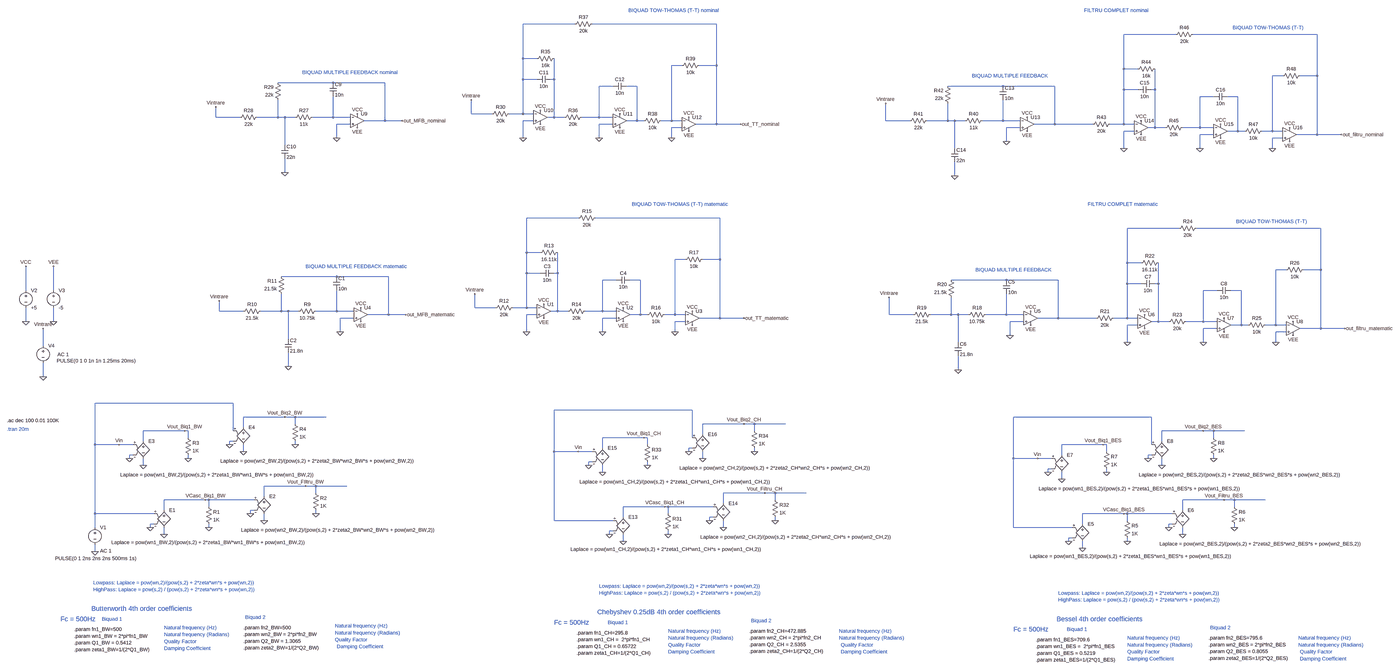
[diagram p0: schematic TJ_ARY_NOMINAL_E24.asc, whole sheet]
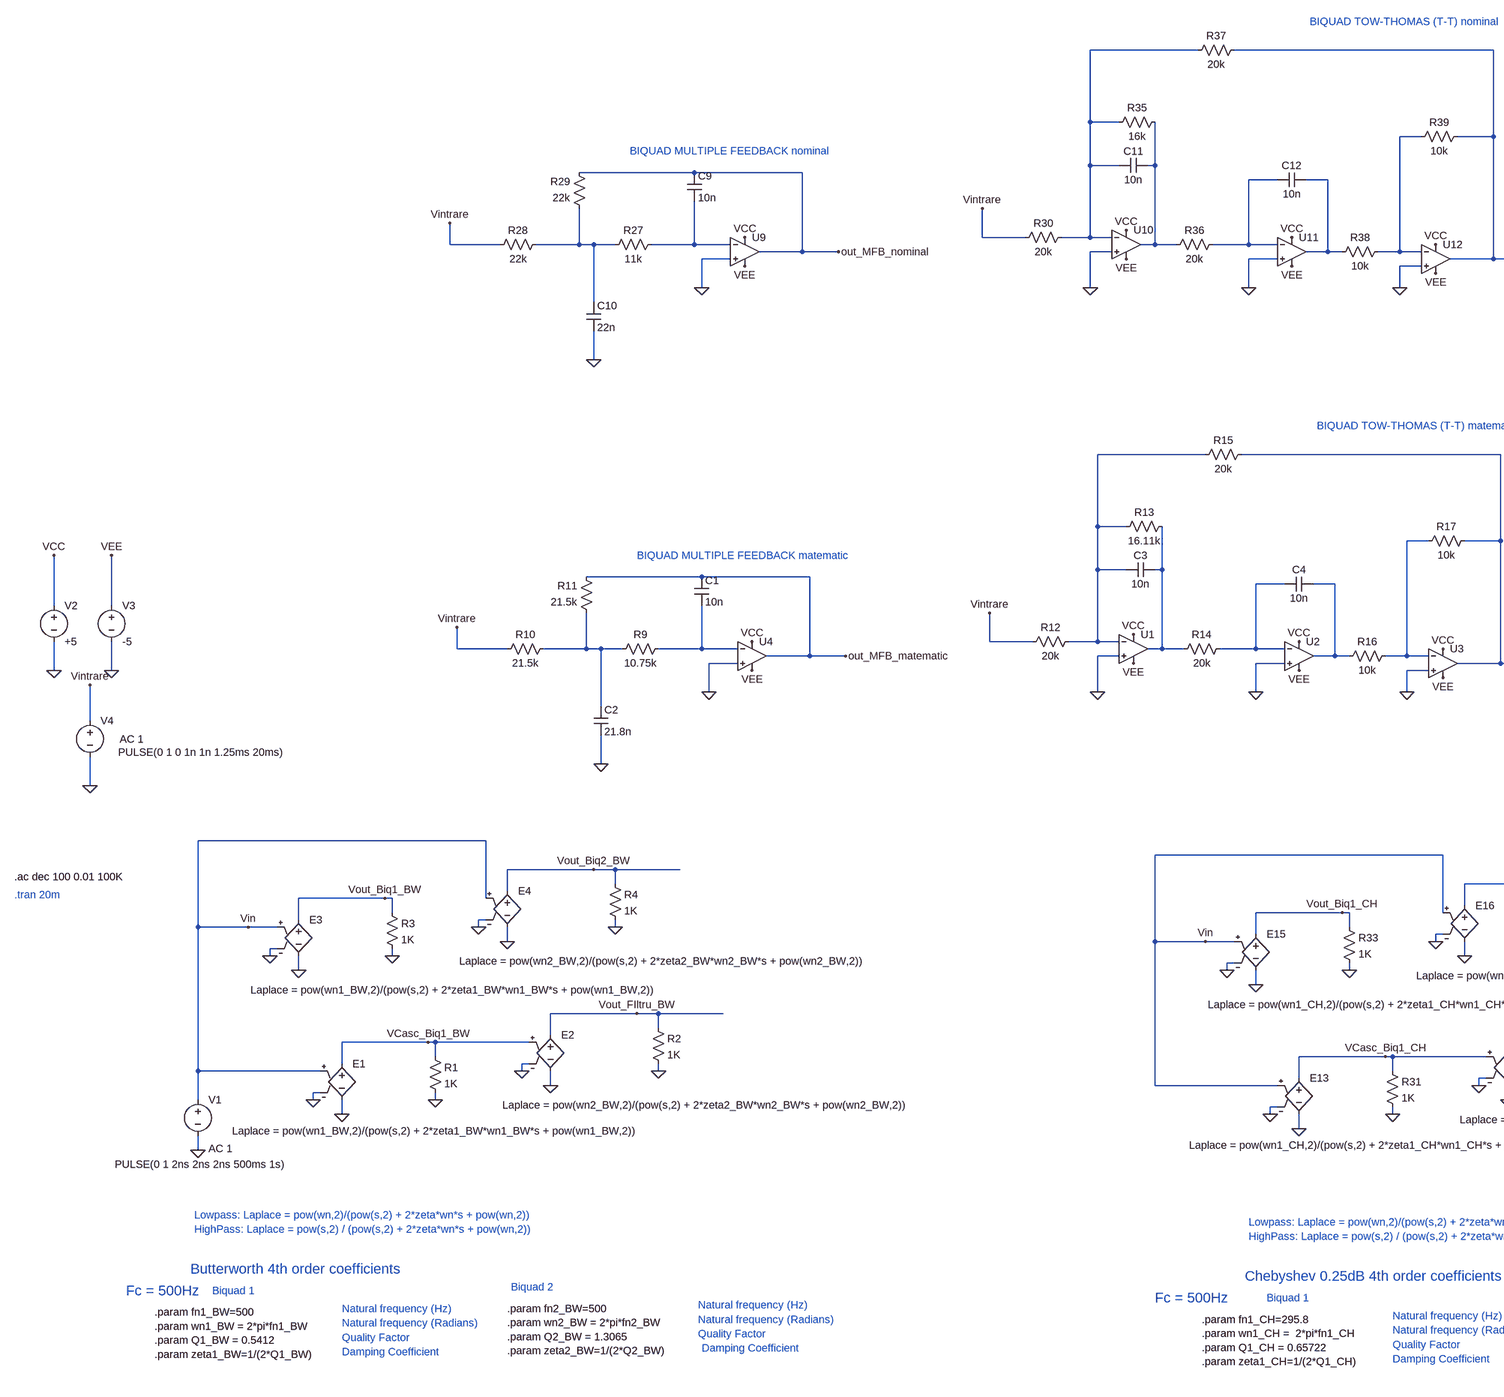
[diagram p1: schematic TJ_ARY_NOMINAL_E24.asc, part, row 1 of 1, column 1 of 2]
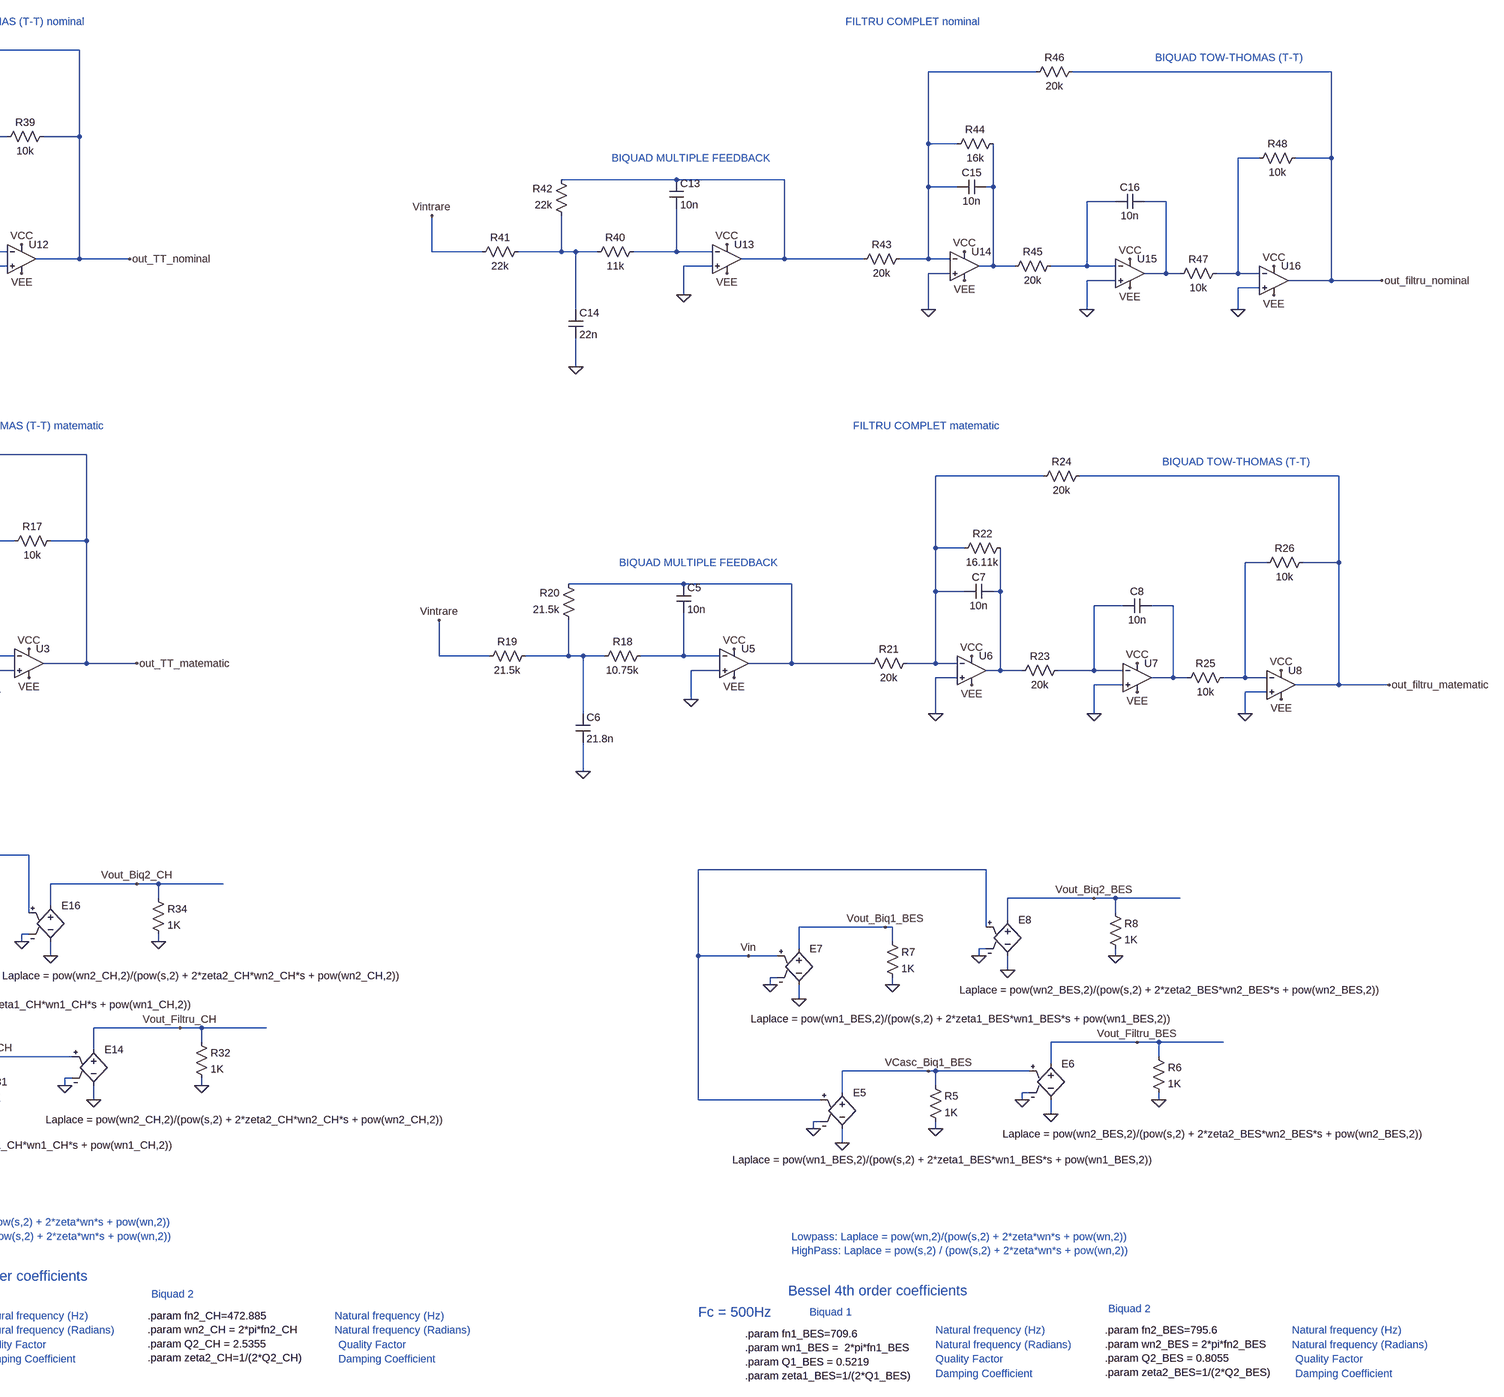
[diagram p2: schematic TJ_ARY_NOMINAL_E24.asc, part, row 1 of 1, column 2 of 2]
TJ_ARY_NOMINAL_E24.asc, the LTspice schematic file:
Version 4.1
SHEET 1 6776 2576
WIRE 2480 -1856 2240 -1856
WIRE 3136 -1856 2560 -1856
WIRE 5264 -1808 5024 -1808
WIRE 5920 -1808 5344 -1808
WIRE 2240 -1696 2240 -1856
WIRE 2304 -1696 2240 -1696
WIRE 2976 -1664 2928 -1664
WIRE 3136 -1664 3136 -1856
WIRE 3136 -1664 3056 -1664
WIRE 5024 -1648 5024 -1808
WIRE 5088 -1648 5024 -1648
WIRE 5760 -1616 5712 -1616
WIRE 5920 -1616 5920 -1808
WIRE 5920 -1616 5840 -1616
WIRE 2240 -1600 2240 -1696
WIRE 2304 -1600 2240 -1600
WIRE 2384 -1600 2384 -1696
WIRE 2384 -1600 2368 -1600
WIRE 1360 -1584 1104 -1584
WIRE 1600 -1584 1360 -1584
WIRE 2656 -1568 2592 -1568
WIRE 2768 -1568 2720 -1568
WIRE 4464 -1568 4208 -1568
WIRE 4704 -1568 4464 -1568
WIRE 5024 -1552 5024 -1648
WIRE 5088 -1552 5024 -1552
WIRE 5168 -1552 5168 -1648
WIRE 5168 -1552 5152 -1552
WIRE 5440 -1520 5376 -1520
WIRE 5552 -1520 5504 -1520
WIRE 2000 -1440 2000 -1504
WIRE 2096 -1440 2000 -1440
WIRE 2240 -1440 2240 -1600
WIRE 2240 -1440 2176 -1440
WIRE 2288 -1440 2240 -1440
WIRE 816 -1424 816 -1472
WIRE 928 -1424 816 -1424
WIRE 1104 -1424 1104 -1504
WIRE 1104 -1424 1008 -1424
WIRE 1136 -1424 1104 -1424
WIRE 1184 -1424 1136 -1424
WIRE 1360 -1424 1360 -1520
WIRE 1360 -1424 1264 -1424
WIRE 1440 -1424 1360 -1424
WIRE 2384 -1424 2384 -1600
WIRE 2384 -1424 2352 -1424
WIRE 2432 -1424 2384 -1424
WIRE 2592 -1424 2592 -1568
WIRE 2592 -1424 2512 -1424
WIRE 2656 -1424 2592 -1424
WIRE 1600 -1408 1600 -1584
WIRE 1600 -1408 1504 -1408
WIRE 1680 -1408 1600 -1408
WIRE 2288 -1408 2240 -1408
WIRE 2768 -1408 2768 -1568
WIRE 2768 -1408 2720 -1408
WIRE 2800 -1408 2768 -1408
WIRE 2928 -1408 2928 -1664
WIRE 2928 -1408 2880 -1408
WIRE 2976 -1408 2928 -1408
WIRE 3920 -1408 3920 -1488
WIRE 4032 -1408 3920 -1408
WIRE 4208 -1408 4208 -1488
WIRE 4208 -1408 4112 -1408
WIRE 4240 -1408 4208 -1408
WIRE 4288 -1408 4240 -1408
WIRE 4464 -1408 4464 -1504
WIRE 4464 -1408 4368 -1408
WIRE 4544 -1408 4464 -1408
WIRE 1440 -1392 1376 -1392
WIRE 2656 -1392 2592 -1392
WIRE 3136 -1392 3136 -1664
WIRE 3136 -1392 3040 -1392
WIRE 3248 -1392 3136 -1392
WIRE 4704 -1392 4704 -1568
WIRE 4704 -1392 4608 -1392
WIRE 4880 -1392 4704 -1392
WIRE 5024 -1392 5024 -1552
WIRE 5024 -1392 4960 -1392
WIRE 5072 -1392 5024 -1392
WIRE 2976 -1376 2928 -1376
WIRE 4544 -1376 4480 -1376
WIRE 5168 -1376 5168 -1552
WIRE 5168 -1376 5136 -1376
WIRE 5216 -1376 5168 -1376
WIRE 5376 -1376 5376 -1520
WIRE 5376 -1376 5296 -1376
WIRE 5440 -1376 5376 -1376
WIRE 5072 -1360 5024 -1360
WIRE 5552 -1360 5552 -1520
WIRE 5552 -1360 5504 -1360
WIRE 5584 -1360 5552 -1360
WIRE 5712 -1360 5712 -1616
WIRE 5712 -1360 5664 -1360
WIRE 5760 -1360 5712 -1360
WIRE 5440 -1344 5376 -1344
WIRE 5920 -1344 5920 -1616
WIRE 5920 -1344 5824 -1344
WIRE 6032 -1344 5920 -1344
WIRE 1376 -1328 1376 -1392
WIRE 2240 -1328 2240 -1408
WIRE 2592 -1328 2592 -1392
WIRE 2928 -1328 2928 -1376
WIRE 5760 -1328 5712 -1328
WIRE 4480 -1312 4480 -1376
WIRE 1136 -1296 1136 -1424
WIRE 4240 -1280 4240 -1408
WIRE 5024 -1280 5024 -1360
WIRE 5376 -1280 5376 -1344
WIRE 5712 -1280 5712 -1328
WIRE 1136 -1168 1136 -1232
WIRE 4240 -1152 4240 -1216
WIRE 2496 -944 2256 -944
WIRE 3152 -944 2576 -944
WIRE 5280 -896 5040 -896
WIRE 5936 -896 5360 -896
WIRE 2256 -784 2256 -944
WIRE 2320 -784 2256 -784
WIRE 2992 -752 2944 -752
WIRE 3152 -752 3152 -944
WIRE 3152 -752 3072 -752
WIRE 5040 -736 5040 -896
WIRE 5104 -736 5040 -736
WIRE 5776 -704 5728 -704
WIRE 5936 -704 5936 -896
WIRE 5936 -704 5856 -704
WIRE 2256 -688 2256 -784
WIRE 2320 -688 2256 -688
WIRE 2400 -688 2400 -784
WIRE 2400 -688 2384 -688
WIRE 1376 -672 1120 -672
WIRE 1616 -672 1376 -672
WIRE 2672 -656 2608 -656
WIRE 2784 -656 2736 -656
WIRE 4480 -656 4224 -656
WIRE 4720 -656 4480 -656
WIRE 5040 -640 5040 -736
WIRE 5104 -640 5040 -640
WIRE 5184 -640 5184 -736
WIRE 5184 -640 5168 -640
WIRE -64 -608 -64 -720
WIRE 64 -608 64 -720
WIRE 5456 -608 5392 -608
WIRE 5568 -608 5520 -608
WIRE 2016 -528 2016 -592
WIRE 2112 -528 2016 -528
WIRE 2256 -528 2256 -688
WIRE 2256 -528 2192 -528
WIRE 2304 -528 2256 -528
WIRE 832 -512 832 -560
WIRE 944 -512 832 -512
WIRE 1120 -512 1120 -592
WIRE 1120 -512 1024 -512
WIRE 1152 -512 1120 -512
WIRE 1200 -512 1152 -512
WIRE 1376 -512 1376 -608
WIRE 1376 -512 1280 -512
WIRE 1456 -512 1376 -512
WIRE 2400 -512 2400 -688
WIRE 2400 -512 2368 -512
WIRE 2448 -512 2400 -512
WIRE 2608 -512 2608 -656
WIRE 2608 -512 2528 -512
WIRE 2672 -512 2608 -512
WIRE 1616 -496 1616 -672
WIRE 1616 -496 1520 -496
WIRE 1696 -496 1616 -496
WIRE 2304 -496 2256 -496
WIRE 2784 -496 2784 -656
WIRE 2784 -496 2736 -496
WIRE 2816 -496 2784 -496
WIRE 2944 -496 2944 -752
WIRE 2944 -496 2896 -496
WIRE 2992 -496 2944 -496
WIRE 3936 -496 3936 -576
WIRE 4048 -496 3936 -496
WIRE 4224 -496 4224 -576
WIRE 4224 -496 4128 -496
WIRE 4256 -496 4224 -496
WIRE 4304 -496 4256 -496
WIRE 4480 -496 4480 -592
WIRE 4480 -496 4384 -496
WIRE 4560 -496 4480 -496
WIRE 1456 -480 1392 -480
WIRE 2672 -480 2608 -480
WIRE 3152 -480 3152 -752
WIRE 3152 -480 3056 -480
WIRE 3264 -480 3152 -480
WIRE 4720 -480 4720 -656
WIRE 4720 -480 4624 -480
WIRE 4896 -480 4720 -480
WIRE 5040 -480 5040 -640
WIRE 5040 -480 4976 -480
WIRE 5088 -480 5040 -480
WIRE -64 -464 -64 -528
WIRE 64 -464 64 -528
WIRE 2992 -464 2944 -464
WIRE 4560 -464 4496 -464
WIRE 5184 -464 5184 -640
WIRE 5184 -464 5152 -464
WIRE 5232 -464 5184 -464
WIRE 5392 -464 5392 -608
WIRE 5392 -464 5312 -464
WIRE 5456 -464 5392 -464
WIRE 5088 -448 5040 -448
WIRE 5568 -448 5568 -608
WIRE 5568 -448 5520 -448
WIRE 5600 -448 5568 -448
WIRE 5728 -448 5728 -704
WIRE 5728 -448 5680 -448
WIRE 5776 -448 5728 -448
WIRE 5456 -432 5392 -432
WIRE 5936 -432 5936 -704
WIRE 5936 -432 5840 -432
WIRE 6048 -432 5936 -432
WIRE 1392 -416 1392 -480
WIRE 2256 -416 2256 -496
WIRE 2608 -416 2608 -480
WIRE 2944 -416 2944 -464
WIRE 5776 -416 5728 -416
WIRE 4496 -400 4496 -464
WIRE 1152 -384 1152 -512
WIRE 4256 -368 4256 -496
WIRE 5040 -368 5040 -448
WIRE 5392 -368 5392 -432
WIRE 5728 -368 5728 -416
WIRE 16 -352 16 -432
WIRE 1152 -256 1152 -320
WIRE 4256 -240 4256 -304
WIRE 16 -208 16 -272
WIRE 896 -64 256 -64
WIRE 3024 -32 2384 -32
WIRE 1136 0 944 0
WIRE 1184 0 1136 0
WIRE 1328 0 1184 0
WIRE 5152 0 4512 0
WIRE 1184 32 1184 0
WIRE 3264 32 3072 32
WIRE 3312 32 3264 32
WIRE 3456 32 3312 32
WIRE 944 48 944 0
WIRE 672 64 480 64
WIRE 688 64 672 64
WIRE 896 64 896 -64
WIRE 3312 64 3312 32
WIRE 5392 64 5200 64
WIRE 5440 64 5392 64
WIRE 5584 64 5440 64
WIRE 3072 80 3072 32
WIRE 688 96 688 64
WIRE 2800 96 2608 96
WIRE 2816 96 2800 96
WIRE 3024 96 3024 -32
WIRE 5440 96 5440 64
WIRE 480 112 480 64
WIRE 896 112 880 112
WIRE 5200 112 5200 64
WIRE 256 128 256 -64
WIRE 368 128 256 128
WIRE 432 128 368 128
WIRE 880 128 880 112
WIRE 1184 128 1184 112
WIRE 2816 128 2816 96
WIRE 4928 128 4736 128
WIRE 4944 128 4928 128
WIRE 5152 128 5152 0
WIRE 2608 144 2608 96
WIRE 3024 144 3008 144
WIRE 944 160 944 128
WIRE 2384 160 2384 -32
WIRE 2496 160 2384 160
WIRE 2560 160 2496 160
WIRE 3008 160 3008 144
WIRE 3312 160 3312 144
WIRE 4944 160 4944 128
WIRE 432 176 416 176
WIRE 4736 176 4736 128
WIRE 5152 176 5136 176
WIRE 416 192 416 176
WIRE 688 192 688 176
WIRE 3072 192 3072 160
WIRE 4512 192 4512 0
WIRE 4624 192 4512 192
WIRE 4688 192 4624 192
WIRE 5136 192 5136 176
WIRE 5440 192 5440 176
WIRE 2560 208 2544 208
WIRE 480 224 480 192
WIRE 2544 224 2544 208
WIRE 2816 224 2816 208
WIRE 5200 224 5200 192
WIRE 4688 240 4672 240
WIRE 2608 256 2608 224
WIRE 4672 256 4672 240
WIRE 4944 256 4944 240
WIRE 4736 288 4736 256
WIRE 1232 320 1040 320
WIRE 1280 320 1232 320
WIRE 1424 320 1280 320
WIRE 1280 352 1280 320
WIRE 3360 352 3168 352
WIRE 3408 352 3360 352
WIRE 3552 352 3408 352
WIRE 1040 368 1040 320
WIRE 768 384 576 384
WIRE 784 384 768 384
WIRE 992 384 784 384
WIRE 3408 384 3408 352
WIRE 5488 384 5296 384
WIRE 5536 384 5488 384
WIRE 5680 384 5536 384
WIRE 3168 400 3168 352
WIRE 784 416 784 384
WIRE 2896 416 2704 416
WIRE 2912 416 2896 416
WIRE 3120 416 2912 416
WIRE 5536 416 5536 384
WIRE 576 432 576 384
WIRE 992 432 976 432
WIRE 5296 432 5296 384
WIRE 256 448 256 128
WIRE 528 448 256 448
WIRE 976 448 976 432
WIRE 1280 448 1280 432
WIRE 2912 448 2912 416
WIRE 5024 448 4832 448
WIRE 5040 448 5024 448
WIRE 5248 448 5040 448
WIRE 2704 464 2704 416
WIRE 3120 464 3104 464
WIRE 1040 480 1040 448
WIRE 2384 480 2384 160
WIRE 2656 480 2384 480
WIRE 3104 480 3104 464
WIRE 3408 480 3408 464
WIRE 5040 480 5040 448
WIRE 528 496 512 496
WIRE 4832 496 4832 448
WIRE 5248 496 5232 496
WIRE 256 512 256 448
WIRE 512 512 512 496
WIRE 784 512 784 496
WIRE 3168 512 3168 480
WIRE 4512 512 4512 192
WIRE 4784 512 4512 512
WIRE 5232 512 5232 496
WIRE 5536 512 5536 496
WIRE 2656 528 2640 528
WIRE 576 544 576 512
WIRE 2640 544 2640 528
WIRE 2912 544 2912 528
WIRE 5296 544 5296 512
WIRE 4784 560 4768 560
WIRE 2704 576 2704 544
WIRE 4768 576 4768 560
WIRE 5040 576 5040 560
WIRE 4832 608 4832 576
WIRE 256 624 256 592
FLAG 256 624 0
FLAG 512 512 0
FLAG 576 544 0
FLAG 768 384 VCasc_Biq1_BW
FLAG 976 448 0
FLAG 1040 480 0
FLAG 1232 320 Vout_FIltru_BW
FLAG 784 512 0
FLAG 1280 448 0
FLAG 368 128 Vin
FLAG 416 192 0
FLAG 480 224 0
FLAG 672 64 Vout_Biq1_BW
FLAG 880 128 0
FLAG 944 160 0
FLAG 1136 0 Vout_Biq2_BW
FLAG 688 192 0
FLAG 1184 128 0
FLAG 4768 576 0
FLAG 4832 608 0
FLAG 5024 448 VCasc_Biq1_BES
FLAG 5232 512 0
FLAG 5296 544 0
FLAG 5488 384 Vout_Filtru_BES
FLAG 5040 576 0
FLAG 5536 512 0
FLAG 4624 192 Vin
FLAG 4672 256 0
FLAG 4736 288 0
FLAG 4928 128 Vout_Biq1_BES
FLAG 5136 192 0
FLAG 5200 224 0
FLAG 5392 64 Vout_Biq2_BES
FLAG 4944 256 0
FLAG 5440 192 0
FLAG -64 -464 0
FLAG 64 -464 0
FLAG 16 -208 0
FLAG -64 -720 VCC
FLAG 64 -720 VEE
FLAG 16 -432 Vintrare
FLAG 1392 -416 0
FLAG 1152 -256 0
FLAG 1488 -528 VCC
FLAG 1488 -464 VEE
FLAG 832 -560 Vintrare
FLAG 1696 -496 out_MFB_matematic
FLAG 2944 -416 0
FLAG 2608 -416 0
FLAG 2256 -416 0
FLAG 2016 -592 Vintrare
FLAG 2336 -480 VEE
FLAG 2704 -464 VEE
FLAG 3024 -448 VEE
FLAG 2336 -544 VCC
FLAG 2704 -528 VCC
FLAG 3024 -512 VCC
FLAG 3264 -480 out_TT_matematic
FLAG 4496 -400 0
FLAG 4256 -240 0
FLAG 4592 -512 VCC
FLAG 4592 -448 VEE
FLAG 5728 -368 0
FLAG 5392 -368 0
FLAG 5040 -368 0
FLAG 5120 -432 VEE
FLAG 5488 -416 VEE
FLAG 5808 -400 VEE
FLAG 5120 -496 VCC
FLAG 5488 -480 VCC
FLAG 5808 -464 VCC
FLAG 3936 -576 Vintrare
FLAG 6048 -432 out_filtru_matematic
FLAG 2640 544 0
FLAG 2704 576 0
FLAG 2896 416 VCasc_Biq1_CH
FLAG 3104 480 0
FLAG 3168 512 0
FLAG 3360 352 Vout_Filtru_CH
FLAG 2912 544 0
FLAG 3408 480 0
FLAG 2496 160 Vin
FLAG 2544 224 0
FLAG 2608 256 0
FLAG 2800 96 Vout_Biq1_CH
FLAG 3008 160 0
FLAG 3072 192 0
FLAG 3264 32 Vout_Biq2_CH
FLAG 2816 224 0
FLAG 3312 160 0
FLAG 1376 -1328 0
FLAG 1136 -1168 0
FLAG 1472 -1440 VCC
FLAG 1472 -1376 VEE
FLAG 816 -1472 Vintrare
FLAG 1680 -1408 out_MFB_nominal
FLAG 2928 -1328 0
FLAG 2592 -1328 0
FLAG 2240 -1328 0
FLAG 2000 -1504 Vintrare
FLAG 2320 -1392 VEE
FLAG 2688 -1376 VEE
FLAG 3008 -1360 VEE
FLAG 2320 -1456 VCC
FLAG 2688 -1440 VCC
FLAG 3008 -1424 VCC
FLAG 3248 -1392 out_TT_nominal
FLAG 4480 -1312 0
FLAG 4240 -1152 0
FLAG 4576 -1424 VCC
FLAG 4576 -1360 VEE
FLAG 5712 -1280 0
FLAG 5376 -1280 0
FLAG 5024 -1280 0
FLAG 5104 -1344 VEE
FLAG 5472 -1328 VEE
FLAG 5792 -1312 VEE
FLAG 5104 -1408 VCC
FLAG 5472 -1392 VCC
FLAG 5792 -1376 VCC
FLAG 3920 -1488 Vintrare
FLAG 6032 -1344 out_filtru_nominal
SYMBOL voltage 256 496 R0
WINDOW 123 24 124 Left 2
WINDOW 39 0 0 Left 2
WINDOW 3 -185 159 Left 2
SYMATTR Value2 AC 1
SYMATTR Value PULSE(0 1 2ns 2ns 2ns 500ms 1s)
SYMATTR InstName V1
SYMBOL e 576 416 R0
WINDOW 3 -244 165 Left 2
SYMATTR Value Laplace = pow(wn1_BW,2)/(pow(s,2) + 2*zeta1_BW*wn1_BW*s + pow(wn1_BW,2))
SYMATTR InstName E1
SYMBOL e 1040 352 R0
WINDOW 3 -107 172 Left 2
SYMATTR Value Laplace = pow(wn2_BW,2)/(pow(s,2) + 2*zeta2_BW*wn2_BW*s + pow(wn2_BW,2))
SYMATTR InstName E2
SYMBOL res 768 400 R0
SYMATTR InstName R1
SYMATTR Value 1K
SYMBOL res 1264 336 R0
SYMATTR InstName R2
SYMATTR Value 1K
SYMBOL e 480 96 R0
WINDOW 3 -107 172 Left 2
SYMATTR Value Laplace = pow(wn1_BW,2)/(pow(s,2) + 2*zeta1_BW*wn1_BW*s + pow(wn1_BW,2))
SYMATTR InstName E3
SYMBOL e 944 32 R0
WINDOW 3 -107 172 Left 2
SYMATTR Value Laplace = pow(wn2_BW,2)/(pow(s,2) + 2*zeta2_BW*wn2_BW*s + pow(wn2_BW,2))
SYMATTR InstName E4
SYMBOL res 672 80 R0
SYMATTR InstName R3
SYMATTR Value 1K
SYMBOL res 1168 16 R0
SYMATTR InstName R4
SYMATTR Value 1K
SYMBOL e 4832 480 R0
WINDOW 3 -244 165 Left 2
SYMATTR Value Laplace = pow(wn1_BES,2)/(pow(s,2) + 2*zeta1_BES*wn1_BES*s + pow(wn1_BES,2))
SYMATTR InstName E5
SYMBOL e 5296 416 R0
WINDOW 3 -107 172 Left 2
SYMATTR Value Laplace = pow(wn2_BES,2)/(pow(s,2) + 2*zeta2_BES*wn2_BES*s + pow(wn2_BES,2))
SYMATTR InstName E6
SYMBOL res 5024 464 R0
SYMATTR InstName R5
SYMATTR Value 1K
SYMBOL res 5520 400 R0
SYMATTR InstName R6
SYMATTR Value 1K
SYMBOL e 4736 160 R0
WINDOW 3 -107 172 Left 2
SYMATTR Value Laplace = pow(wn1_BES,2)/(pow(s,2) + 2*zeta1_BES*wn1_BES*s + pow(wn1_BES,2))
SYMATTR InstName E7
SYMBOL e 5200 96 R0
WINDOW 3 -107 172 Left 2
SYMATTR Value Laplace = pow(wn2_BES,2)/(pow(s,2) + 2*zeta2_BES*wn2_BES*s + pow(wn2_BES,2))
SYMATTR InstName E8
SYMBOL res 4928 144 R0
SYMATTR InstName R7
SYMATTR Value 1K
SYMBOL res 5424 80 R0
SYMATTR InstName R8
SYMATTR Value 1K
SYMBOL voltage -64 -624 R0
SYMATTR InstName V2
SYMATTR Value +5
SYMBOL voltage 64 -624 R0
SYMATTR InstName V3
SYMATTR Value -5
SYMBOL voltage 16 -368 R0
WINDOW 3 63 86 Left 2
WINDOW 123 66 57 Left 2
WINDOW 39 0 0 Left 0
SYMATTR Value PULSE(0 1 0 1n 1n 1.25ms 20ms)
SYMATTR Value2 AC 1
SYMATTR InstName V4
SYMBOL OpAmps\\UniversalOpAmp2 1488 -496 R0
SYMATTR InstName U4
SYMBOL res 1296 -528 R90
WINDOW 0 0 56 VBottom 2
WINDOW 3 32 56 VTop 2
SYMATTR InstName R9
SYMATTR Value 10.75k
SYMBOL res 1040 -528 R90
WINDOW 0 0 56 VBottom 2
WINDOW 3 32 56 VTop 2
SYMATTR InstName R10
SYMATTR Value 21.5k
SYMBOL res 1136 -576 R180
WINDOW 0 36 76 Left 2
WINDOW 3 36 40 Left 2
SYMATTR InstName R11
SYMATTR Value 21.5k
SYMBOL cap 1360 -672 R0
SYMATTR InstName C1
SYMATTR Value 10n
SYMBOL cap 1136 -384 R0
SYMATTR InstName C2
SYMATTR Value 21.8n
SYMBOL OpAmps\\UniversalOpAmp2 2336 -512 R0
SYMATTR InstName U1
SYMBOL OpAmps\\UniversalOpAmp2 2704 -496 R0
SYMATTR InstName U2
SYMBOL OpAmps\\UniversalOpAmp2 3024 -480 R0
SYMATTR InstName U3
SYMBOL res 2208 -544 R90
WINDOW 0 0 56 VBottom 2
WINDOW 3 32 56 VTop 2
SYMATTR InstName R12
SYMATTR Value 20k
SYMBOL res 2416 -800 R90
WINDOW 0 0 56 VBottom 2
WINDOW 3 32 56 VTop 2
SYMATTR InstName R13
SYMATTR Value 16.11k
SYMBOL res 2544 -528 R90
WINDOW 0 0 56 VBottom 2
WINDOW 3 32 56 VTop 2
SYMATTR InstName R14
SYMATTR Value 20k
SYMBOL res 2592 -960 R90
WINDOW 0 0 56 VBottom 2
WINDOW 3 32 56 VTop 2
SYMATTR InstName R15
SYMATTR Value 20k
SYMBOL res 2912 -512 R90
WINDOW 0 0 56 VBottom 2
WINDOW 3 32 56 VTop 2
SYMATTR InstName R16
SYMATTR Value 10k
SYMBOL res 3088 -768 R90
WINDOW 0 0 56 VBottom 2
WINDOW 3 32 56 VTop 2
SYMATTR InstName R17
SYMATTR Value 10k
SYMBOL cap 2384 -704 R90
WINDOW 0 0 32 VBottom 2
WINDOW 3 32 32 VTop 2
SYMATTR InstName C3
SYMATTR Value 10n
SYMBOL cap 2736 -672 R90
WINDOW 0 0 32 VBottom 2
WINDOW 3 32 32 VTop 2
SYMATTR InstName C4
SYMATTR Value 10n
SYMBOL OpAmps\\UniversalOpAmp2 4592 -480 R0
SYMATTR InstName U5
SYMBOL res 4400 -512 R90
WINDOW 0 0 56 VBottom 2
WINDOW 3 32 56 VTop 2
SYMATTR InstName R18
SYMATTR Value 10.75k
SYMBOL res 4144 -512 R90
WINDOW 0 0 56 VBottom 2
WINDOW 3 32 56 VTop 2
SYMATTR InstName R19
SYMATTR Value 21.5k
SYMBOL res 4240 -560 R180
WINDOW 0 36 76 Left 2
WINDOW 3 36 40 Left 2
SYMATTR InstName R20
SYMATTR Value 21.5k
SYMBOL cap 4464 -656 R0
SYMATTR InstName C5
SYMATTR Value 10n
SYMBOL cap 4240 -368 R0
SYMATTR InstName C6
SYMATTR Value 21.8n
SYMBOL OpAmps\\UniversalOpAmp2 5120 -464 R0
SYMATTR InstName U6
SYMBOL OpAmps\\UniversalOpAmp2 5488 -448 R0
SYMATTR InstName U7
SYMBOL OpAmps\\UniversalOpAmp2 5808 -432 R0
SYMATTR InstName U8
SYMBOL res 4992 -496 R90
WINDOW 0 0 56 VBottom 2
WINDOW 3 32 56 VTop 2
SYMATTR InstName R21
SYMATTR Value 20k
SYMBOL res 5200 -752 R90
WINDOW 0 0 56 VBottom 2
WINDOW 3 32 56 VTop 2
SYMATTR InstName R22
SYMATTR Value 16.11k
SYMBOL res 5328 -480 R90
WINDOW 0 0 56 VBottom 2
WINDOW 3 32 56 VTop 2
SYMATTR InstName R23
SYMATTR Value 20k
SYMBOL res 5376 -912 R90
WINDOW 0 0 56 VBottom 2
WINDOW 3 32 56 VTop 2
SYMATTR InstName R24
SYMATTR Value 20k
SYMBOL res 5696 -464 R90
WINDOW 0 0 56 VBottom 2
WINDOW 3 32 56 VTop 2
SYMATTR InstName R25
SYMATTR Value 10k
SYMBOL res 5872 -720 R90
WINDOW 0 0 56 VBottom 2
WINDOW 3 32 56 VTop 2
SYMATTR InstName R26
SYMATTR Value 10k
SYMBOL cap 5168 -656 R90
WINDOW 0 0 32 VBottom 2
WINDOW 3 32 32 VTop 2
SYMATTR InstName C7
SYMATTR Value 10n
SYMBOL cap 5520 -624 R90
WINDOW 0 0 32 VBottom 2
WINDOW 3 32 32 VTop 2
SYMATTR InstName C8
SYMATTR Value 10n
SYMBOL e 2704 448 R0
WINDOW 3 -244 165 Left 2
SYMATTR Value Laplace = pow(wn1_CH,2)/(pow(s,2) + 2*zeta1_CH*wn1_CH*s + pow(wn1_CH,2))
SYMATTR InstName E13
SYMBOL e 3168 384 R0
WINDOW 3 -107 172 Left 2
SYMATTR Value Laplace = pow(wn2_CH,2)/(pow(s,2) + 2*zeta2_CH*wn2_CH*s + pow(wn2_CH,2))
SYMATTR InstName E14
SYMBOL res 2896 432 R0
SYMATTR InstName R31
SYMATTR Value 1K
SYMBOL res 3392 368 R0
SYMATTR InstName R32
SYMATTR Value 1K
SYMBOL e 2608 128 R0
WINDOW 3 -107 172 Left 2
SYMATTR Value Laplace = pow(wn1_CH,2)/(pow(s,2) + 2*zeta1_CH*wn1_CH*s + pow(wn1_CH,2))
SYMATTR InstName E15
SYMBOL e 3072 64 R0
WINDOW 3 -107 172 Left 2
SYMATTR Value Laplace = pow(wn2_CH,2)/(pow(s,2) + 2*zeta2_CH*wn2_CH*s + pow(wn2_CH,2))
SYMATTR InstName E16
SYMBOL res 2800 112 R0
SYMATTR InstName R33
SYMATTR Value 1K
SYMBOL res 3296 48 R0
SYMATTR InstName R34
SYMATTR Value 1K
SYMBOL OpAmps\\UniversalOpAmp2 1472 -1408 R0
SYMATTR InstName U9
SYMBOL res 1280 -1440 R90
WINDOW 0 0 56 VBottom 2
WINDOW 3 32 56 VTop 2
SYMATTR InstName R27
SYMATTR Value 11k
SYMBOL res 1024 -1440 R90
WINDOW 0 0 56 VBottom 2
WINDOW 3 32 56 VTop 2
SYMATTR InstName R28
SYMATTR Value 22k
SYMBOL res 1120 -1488 R180
WINDOW 0 36 76 Left 2
WINDOW 3 36 40 Left 2
SYMATTR InstName R29
SYMATTR Value 22k
SYMBOL cap 1344 -1584 R0
SYMATTR InstName C9
SYMATTR Value 10n
SYMBOL cap 1120 -1296 R0
SYMATTR InstName C10
SYMATTR Value 22n
SYMBOL OpAmps\\UniversalOpAmp2 2320 -1424 R0
SYMATTR InstName U10
SYMBOL OpAmps\\UniversalOpAmp2 2688 -1408 R0
SYMATTR InstName U11
SYMBOL OpAmps\\UniversalOpAmp2 3008 -1392 R0
SYMATTR InstName U12
SYMBOL res 2192 -1456 R90
WINDOW 0 0 56 VBottom 2
WINDOW 3 32 56 VTop 2
SYMATTR InstName R30
SYMATTR Value 20k
SYMBOL res 2400 -1712 R90
WINDOW 0 0 56 VBottom 2
WINDOW 3 32 56 VTop 2
SYMATTR InstName R35
SYMATTR Value 16k
SYMBOL res 2528 -1440 R90
WINDOW 0 0 56 VBottom 2
WINDOW 3 32 56 VTop 2
SYMATTR InstName R36
SYMATTR Value 20k
SYMBOL res 2576 -1872 R90
WINDOW 0 0 56 VBottom 2
WINDOW 3 32 56 VTop 2
SYMATTR InstName R37
SYMATTR Value 20k
SYMBOL res 2896 -1424 R90
WINDOW 0 0 56 VBottom 2
WINDOW 3 32 56 VTop 2
SYMATTR InstName R38
SYMATTR Value 10k
SYMBOL res 3072 -1680 R90
WINDOW 0 0 56 VBottom 2
WINDOW 3 32 56 VTop 2
SYMATTR InstName R39
SYMATTR Value 10k
SYMBOL cap 2368 -1616 R90
WINDOW 0 0 32 VBottom 2
WINDOW 3 32 32 VTop 2
SYMATTR InstName C11
SYMATTR Value 10n
SYMBOL cap 2720 -1584 R90
WINDOW 0 0 32 VBottom 2
WINDOW 3 32 32 VTop 2
SYMATTR InstName C12
SYMATTR Value 10n
SYMBOL OpAmps\\UniversalOpAmp2 4576 -1392 R0
SYMATTR InstName U13
SYMBOL res 4384 -1424 R90
WINDOW 0 0 56 VBottom 2
WINDOW 3 32 56 VTop 2
SYMATTR InstName R40
SYMATTR Value 11k
SYMBOL res 4128 -1424 R90
WINDOW 0 0 56 VBottom 2
WINDOW 3 32 56 VTop 2
SYMATTR InstName R41
SYMATTR Value 22k
SYMBOL res 4224 -1472 R180
WINDOW 0 36 76 Left 2
WINDOW 3 36 40 Left 2
SYMATTR InstName R42
SYMATTR Value 22k
SYMBOL cap 4448 -1568 R0
SYMATTR InstName C13
SYMATTR Value 10n
SYMBOL cap 4224 -1280 R0
SYMATTR InstName C14
SYMATTR Value 22n
SYMBOL OpAmps\\UniversalOpAmp2 5104 -1376 R0
SYMATTR InstName U14
SYMBOL OpAmps\\UniversalOpAmp2 5472 -1360 R0
SYMATTR InstName U15
SYMBOL OpAmps\\UniversalOpAmp2 5792 -1344 R0
SYMATTR InstName U16
SYMBOL res 4976 -1408 R90
WINDOW 0 0 56 VBottom 2
WINDOW 3 32 56 VTop 2
SYMATTR InstName R43
SYMATTR Value 20k
SYMBOL res 5184 -1664 R90
WINDOW 0 0 56 VBottom 2
WINDOW 3 32 56 VTop 2
SYMATTR InstName R44
SYMATTR Value 16k
SYMBOL res 5312 -1392 R90
WINDOW 0 0 56 VBottom 2
WINDOW 3 32 56 VTop 2
SYMATTR InstName R45
SYMATTR Value 20k
SYMBOL res 5360 -1824 R90
WINDOW 0 0 56 VBottom 2
WINDOW 3 32 56 VTop 2
SYMATTR InstName R46
SYMATTR Value 20k
SYMBOL res 5680 -1376 R90
WINDOW 0 0 56 VBottom 2
WINDOW 3 32 56 VTop 2
SYMATTR InstName R47
SYMATTR Value 10k
SYMBOL res 5856 -1632 R90
WINDOW 0 0 56 VBottom 2
WINDOW 3 32 56 VTop 2
SYMATTR InstName R48
SYMATTR Value 10k
SYMBOL cap 5152 -1568 R90
WINDOW 0 0 32 VBottom 2
WINDOW 3 32 32 VTop 2
SYMATTR InstName C15
SYMATTR Value 10n
SYMBOL cap 5504 -1536 R90
WINDOW 0 0 32 VBottom 2
WINDOW 3 32 32 VTop 2
SYMATTR InstName C16
SYMATTR Value 10n
TEXT 160 984 Left 2 !.param fn1_BW=500\n.param wn1_BW = 2*pi*fn1_BW\n.param Q1_BW = 0.5412\n.param zeta1_BW=1/(2*Q1_BW)
TEXT -152 16 Left 2 !.ac dec 100 0.01 100K
TEXT 576 976 Left 2 ;Natural frequency (Hz)
TEXT 576 1008 Left 2 ;Natural frequency (Radians)
TEXT 576 1072 Left 2 ;Damping Coefficient
TEXT 288 936 Left 2 ;Biquad 1
TEXT 248 768 Left 2 ;Lowpass: Laplace = pow(wn,2)/(pow(s,2) + 2*zeta*wn*s + pow(wn,2))\nHighPass: Laplace = pow(s,2) / (pow(s,2) + 2*zeta*wn*s + pow(wn,2))
TEXT 944 976 Left 2 !.param fn2_BW=500\n.param wn2_BW = 2*pi*fn2_BW\n.param Q2_BW = 1.3065\n.param zeta2_BW=1/(2*Q2_BW)
TEXT 1368 968 Left 2 ;Natural frequency (Hz)
TEXT 1368 1000 Left 2 ;Natural frequency (Radians)
TEXT 1376 1064 Left 2 ;Damping Coefficient
TEXT 576 1040 Left 2 ;Quality Factor
TEXT 1368 1032 Left 2 ;Quality Factor
TEXT 240 888 Left 3 ;Butterworth 4th order coefficients
TEXT 952 928 Left 2 ;Biquad 2
TEXT 4616 1032 Left 2 !.param fn1_BES=709.6\n.param wn1_BES =  2*pi*fn1_BES\n.param Q1_BES = 0.5219\n.param zeta1_BES=1/(2*Q1_BES)
TEXT 5040 1024 Left 2 ;Natural frequency (Hz)
TEXT 5040 1056 Left 2 ;Natural frequency (Radians)
TEXT 5040 1120 Left 2 ;Damping Coefficient
TEXT 4760 984 Left 2 ;Biquad 1
TEXT 4720 816 Left 2 ;Lowpass: Laplace = pow(wn,2)/(pow(s,2) + 2*zeta*wn*s + pow(wn,2))\nHighPass: Laplace = pow(s,2) / (pow(s,2) + 2*zeta*wn*s + pow(wn,2))
TEXT 5416 1024 Left 2 !.param fn2_BES=795.6\n.param wn2_BES = 2*pi*fn2_BES\n.param Q2_BES = 0.8055\n.param zeta2_BES=1/(2*Q2_BES)
TEXT 5832 1024 Left 2 ;Natural frequency (Hz)
TEXT 5832 1056 Left 2 ;Natural frequency (Radians)
TEXT 5840 1120 Left 2 ;Damping Coefficient
TEXT 5040 1088 Left 2 ;Quality Factor
TEXT 5840 1088 Left 2 ;Quality Factor
TEXT 4712 936 Left 3 ;Bessel 4th order coefficients
TEXT 5424 976 Left 2 ;Biquad 2
TEXT 4512 984 Left 3 ;Fc = 500Hz
TEXT 96 936 Left 3 ;Fc = 500Hz
TEXT 1232 -720 Left 2 ;BIQUAD MULTIPLE FEEDBACK matematic
TEXT 2744 -1008 Left 2 ;BIQUAD TOW-THOMAS (T-T) matematic
TEXT 4336 -704 Left 2 ;BIQUAD MULTIPLE FEEDBACK
TEXT 5544 -928 Left 2 ;BIQUAD TOW-THOMAS (T-T)
TEXT 4856 -1008 Left 2 ;FILTRU COMPLET matematic
TEXT 2488 1000 Left 2 !.param fn1_CH=295.8\n.param wn1_CH =  2*pi*fn1_CH\n.param Q1_CH = 0.65722\n.param zeta1_CH=1/(2*Q1_CH)
TEXT 2912 992 Left 2 ;Natural frequency (Hz)
TEXT 2912 1024 Left 2 ;Natural frequency (Radians)
TEXT 2912 1088 Left 2 ;Damping Coefficient
TEXT 2632 952 Left 2 ;Biquad 1
TEXT 2592 784 Left 2 ;Lowpass: Laplace = pow(wn,2)/(pow(s,2) + 2*zeta*wn*s + pow(wn,2))\nHighPass: Laplace = pow(s,2) / (pow(s,2) + 2*zeta*wn*s + pow(wn,2))
TEXT 3288 992 Left 2 !.param fn2_CH=472.885\n.param wn2_CH = 2*pi*fn2_CH\n.param Q2_CH = 2.5355\n.param zeta2_CH=1/(2*Q2_CH)
TEXT 3704 992 Left 2 ;Natural frequency (Hz)
TEXT 3704 1024 Left 2 ;Natural frequency (Radians)
TEXT 3712 1088 Left 2 ;Damping Coefficient
TEXT 2912 1056 Left 2 ;Quality Factor
TEXT 3712 1056 Left 2 ;Quality Factor
TEXT 2584 904 Left 3 ;Chebyshev 0.25dB 4th order coefficients
TEXT 3296 944 Left 2 ;Biquad 2
TEXT 2384 952 Left 3 ;Fc = 500Hz
TEXT -152 56 Left 2 ;.tran 20m
TEXT 1216 -1632 Left 2 ;BIQUAD MULTIPLE FEEDBACK nominal
TEXT 2728 -1920 Left 2 ;BIQUAD TOW-THOMAS (T-T) nominal
TEXT 4320 -1616 Left 2 ;BIQUAD MULTIPLE FEEDBACK
TEXT 5528 -1840 Left 2 ;BIQUAD TOW-THOMAS (T-T)
TEXT 4840 -1920 Left 2 ;FILTRU COMPLET nominal

The netlist it stands for:
* TJ_ARY_NOMINAL_E24.asc
V1 Vin 0 PULSE(0 1 2ns 2ns 2ns 500ms 1s) AC 1
E1 VCasc_Biq1_BW 0 Vin 0 Laplace = pow(wn1_BW,2)/(pow(s,2) + 2*zeta1_BW*wn1_BW*s + pow(wn1_BW,2))
E2 Vout_FIltru_BW 0 VCasc_Biq1_BW 0 Laplace = pow(wn2_BW,2)/(pow(s,2) + 2*zeta2_BW*wn2_BW*s + pow(wn2_BW,2))
R1 VCasc_Biq1_BW 0 1K
R2 Vout_FIltru_BW 0 1K
E3 Vout_Biq1_BW 0 Vin 0 Laplace = pow(wn1_BW,2)/(pow(s,2) + 2*zeta1_BW*wn1_BW*s + pow(wn1_BW,2))
E4 Vout_Biq2_BW 0 Vin 0 Laplace = pow(wn2_BW,2)/(pow(s,2) + 2*zeta2_BW*wn2_BW*s + pow(wn2_BW,2))
R3 Vout_Biq1_BW 0 1K
R4 Vout_Biq2_BW 0 1K
E5 VCasc_Biq1_BES 0 Vin 0 Laplace = pow(wn1_BES,2)/(pow(s,2) + 2*zeta1_BES*wn1_BES*s + pow(wn1_BES,2))
E6 Vout_Filtru_BES 0 VCasc_Biq1_BES 0 Laplace = pow(wn2_BES,2)/(pow(s,2) + 2*zeta2_BES*wn2_BES*s + pow(wn2_BES,2))
R5 VCasc_Biq1_BES 0 1K
R6 Vout_Filtru_BES 0 1K
E7 Vout_Biq1_BES 0 Vin 0 Laplace = pow(wn1_BES,2)/(pow(s,2) + 2*zeta1_BES*wn1_BES*s + pow(wn1_BES,2))
E8 Vout_Biq2_BES 0 Vin 0 Laplace = pow(wn2_BES,2)/(pow(s,2) + 2*zeta2_BES*wn2_BES*s + pow(wn2_BES,2))
R7 Vout_Biq1_BES 0 1K
R8 Vout_Biq2_BES 0 1K
V2 VCC 0 +5
V3 VEE 0 -5
V4 Vintrare 0 PULSE(0 1 0 1n 1n 1.25ms 20ms) AC 1
X§U4 0 N028 VCC VEE out_MFB_matematic level2 Avol=1Meg GBW=10Meg Slew=10Meg Ilimit=25m Rail=0 Vos=0 En=0 Enk=0 In=0 Ink=0 Rin=500Meg  ; pins In+ In- V+ V- OUT
R9 N028 N027 10.75k
R10 N027 Vintrare 21.5k
R11 N027 out_MFB_matematic 21.5k
C1 out_MFB_matematic N028 10n
C2 N027 0 21.8n
X§U1 0 N016 VCC VEE N020 level2 Avol=1Meg GBW=10Meg Slew=10Meg Ilimit=25m Rail=0 Vos=0 En=0 Enk=0 In=0 Ink=0 Rin=500Meg  ; pins In+ In- V+ V- OUT
X§U2 0 N021 VCC VEE N022 level2 Avol=1Meg GBW=10Meg Slew=10Meg Ilimit=25m Rail=0 Vos=0 En=0 Enk=0 In=0 Ink=0 Rin=500Meg  ; pins In+ In- V+ V- OUT
X§U3 0 N018 VCC VEE out_TT_matematic level2 Avol=1Meg GBW=10Meg Slew=10Meg Ilimit=25m Rail=0 Vos=0 En=0 Enk=0 In=0 Ink=0 Rin=500Meg  ; pins In+ In- V+ V- OUT
R12 N016 Vintrare 20k
R13 N020 N016 16.11k
R14 N021 N020 20k
R15 out_TT_matematic N016 20k
R16 N018 N022 10k
R17 out_TT_matematic N018 10k
C3 N020 N016 10n
C4 N022 N021 10n
X§U5 0 N030 VCC VEE N023 level2 Avol=1Meg GBW=10Meg Slew=10Meg Ilimit=25m Rail=0 Vos=0 En=0 Enk=0 In=0 Ink=0 Rin=500Meg  ; pins In+ In- V+ V- OUT
R18 N030 N029 10.75k
R19 N029 Vintrare 21.5k
R20 N029 N023 21.5k
C5 N023 N030 10n
C6 N029 0 21.8n
X§U6 0 N017 VCC VEE N024 level2 Avol=1Meg GBW=10Meg Slew=10Meg Ilimit=25m Rail=0 Vos=0 En=0 Enk=0 In=0 Ink=0 Rin=500Meg  ; pins In+ In- V+ V- OUT
X§U7 0 N025 VCC VEE N026 level2 Avol=1Meg GBW=10Meg Slew=10Meg Ilimit=25m Rail=0 Vos=0 En=0 Enk=0 In=0 Ink=0 Rin=500Meg  ; pins In+ In- V+ V- OUT
X§U8 0 N019 VCC VEE out_filtru_matematic level2 Avol=1Meg GBW=10Meg Slew=10Meg Ilimit=25m Rail=0 Vos=0 En=0 Enk=0 In=0 Ink=0 Rin=500Meg  ; pins In+ In- V+ V- OUT
R21 N017 N023 20k
R22 N024 N017 16.11k
R23 N025 N024 20k
R24 out_filtru_matematic N017 20k
R25 N019 N026 10k
R26 out_filtru_matematic N019 10k
C7 N024 N017 10n
C8 N026 N025 10n
E13 VCasc_Biq1_CH 0 Vin 0 Laplace = pow(wn1_CH,2)/(pow(s,2) + 2*zeta1_CH*wn1_CH*s + pow(wn1_CH,2))
E14 Vout_Filtru_CH 0 VCasc_Biq1_CH 0 Laplace = pow(wn2_CH,2)/(pow(s,2) + 2*zeta2_CH*wn2_CH*s + pow(wn2_CH,2))
R31 VCasc_Biq1_CH 0 1K
R32 Vout_Filtru_CH 0 1K
E15 Vout_Biq1_CH 0 Vin 0 Laplace = pow(wn1_CH,2)/(pow(s,2) + 2*zeta1_CH*wn1_CH*s + pow(wn1_CH,2))
E16 Vout_Biq2_CH 0 Vin 0 Laplace = pow(wn2_CH,2)/(pow(s,2) + 2*zeta2_CH*wn2_CH*s + pow(wn2_CH,2))
R33 Vout_Biq1_CH 0 1K
R34 Vout_Biq2_CH 0 1K
X§U9 0 N013 VCC VEE out_MFB_nominal level2 Avol=1Meg GBW=10Meg Slew=10Meg Ilimit=25m Rail=0 Vos=0 En=0 Enk=0 In=0 Ink=0 Rin=500Meg  ; pins In+ In- V+ V- OUT
R27 N013 N012 11k
R28 N012 Vintrare 22k
R29 N012 out_MFB_nominal 22k
C9 out_MFB_nominal N013 10n
C10 N012 0 22n
X§U10 0 N001 VCC VEE N005 level2 Avol=1Meg GBW=10Meg Slew=10Meg Ilimit=25m Rail=0 Vos=0 En=0 Enk=0 In=0 Ink=0 Rin=500Meg  ; pins In+ In- V+ V- OUT
X§U11 0 N006 VCC VEE N007 level2 Avol=1Meg GBW=10Meg Slew=10Meg Ilimit=25m Rail=0 Vos=0 En=0 Enk=0 In=0 Ink=0 Rin=500Meg  ; pins In+ In- V+ V- OUT
X§U12 0 N003 VCC VEE out_TT_nominal level2 Avol=1Meg GBW=10Meg Slew=10Meg Ilimit=25m Rail=0 Vos=0 En=0 Enk=0 In=0 Ink=0 Rin=500Meg  ; pins In+ In- V+ V- OUT
R30 N001 Vintrare 20k
R35 N005 N001 16k
R36 N006 N005 20k
R37 out_TT_nominal N001 20k
R38 N003 N007 10k
R39 out_TT_nominal N003 10k
C11 N005 N001 10n
C12 N007 N006 10n
X§U13 0 N015 VCC VEE N008 level2 Avol=1Meg GBW=10Meg Slew=10Meg Ilimit=25m Rail=0 Vos=0 En=0 Enk=0 In=0 Ink=0 Rin=500Meg  ; pins In+ In- V+ V- OUT
R40 N015 N014 11k
R41 N014 Vintrare 22k
R42 N014 N008 22k
C13 N008 N015 10n
C14 N014 0 22n
X§U14 0 N002 VCC VEE N009 level2 Avol=1Meg GBW=10Meg Slew=10Meg Ilimit=25m Rail=0 Vos=0 En=0 Enk=0 In=0 Ink=0 Rin=500Meg  ; pins In+ In- V+ V- OUT
X§U15 0 N010 VCC VEE N011 level2 Avol=1Meg GBW=10Meg Slew=10Meg Ilimit=25m Rail=0 Vos=0 En=0 Enk=0 In=0 Ink=0 Rin=500Meg  ; pins In+ In- V+ V- OUT
X§U16 0 N004 VCC VEE out_filtru_nominal level2 Avol=1Meg GBW=10Meg Slew=10Meg Ilimit=25m Rail=0 Vos=0 En=0 Enk=0 In=0 Ink=0 Rin=500Meg  ; pins In+ In- V+ V- OUT
R43 N002 N008 20k
R44 N009 N002 16k
R45 N010 N009 20k
R46 out_filtru_nominal N002 20k
R47 N004 N011 10k
R48 out_filtru_nominal N004 10k
C15 N009 N002 10n
C16 N011 N010 10n
.param fn1_BW=500
.param wn1_BW = 2*pi*fn1_BW
.param Q1_BW = 0.5412
.param zeta1_BW=1/(2*Q1_BW)
.ac dec 100 0.01 100K
* Natural frequency (Hz)
* Natural frequency (Radians)
* Damping Coefficient
* Biquad 1
* Lowpass: Laplace = pow(wn,2)/(pow(s,2) + 2*zeta*wn*s + pow(wn,2))
* HighPass: Laplace = pow(s,2) / (pow(s,2) + 2*zeta*wn*s + pow(wn,2))
.param fn2_BW=500
.param wn2_BW = 2*pi*fn2_BW
.param Q2_BW = 1.3065
.param zeta2_BW=1/(2*Q2_BW)
* Natural frequency (Hz)
* Natural frequency (Radians)
* Damping Coefficient
* Quality Factor
* Quality Factor
* Butterworth 4th order coefficients
* Biquad 2
.param fn1_BES=709.6
.param wn1_BES =  2*pi*fn1_BES
.param Q1_BES = 0.5219
.param zeta1_BES=1/(2*Q1_BES)
* Natural frequency (Hz)
* Natural frequency (Radians)
* Damping Coefficient
* Biquad 1
* Lowpass: Laplace = pow(wn,2)/(pow(s,2) + 2*zeta*wn*s + pow(wn,2))
* HighPass: Laplace = pow(s,2) / (pow(s,2) + 2*zeta*wn*s + pow(wn,2))
.param fn2_BES=795.6
.param wn2_BES = 2*pi*fn2_BES
.param Q2_BES = 0.8055
.param zeta2_BES=1/(2*Q2_BES)
* Natural frequency (Hz)
* Natural frequency (Radians)
* Damping Coefficient
* Quality Factor
* Quality Factor
* Bessel 4th order coefficients
* Biquad 2
* Fc = 500Hz
* Fc = 500Hz
* BIQUAD MULTIPLE FEEDBACK matematic
* BIQUAD TOW-THOMAS (T-T) matematic
* BIQUAD MULTIPLE FEEDBACK
* BIQUAD TOW-THOMAS (T-T)
* FILTRU COMPLET matematic
.param fn1_CH=295.8
.param wn1_CH =  2*pi*fn1_CH
.param Q1_CH = 0.65722
.param zeta1_CH=1/(2*Q1_CH)
* Natural frequency (Hz)
* Natural frequency (Radians)
* Damping Coefficient
* Biquad 1
* Lowpass: Laplace = pow(wn,2)/(pow(s,2) + 2*zeta*wn*s + pow(wn,2))
* HighPass: Laplace = pow(s,2) / (pow(s,2) + 2*zeta*wn*s + pow(wn,2))
.param fn2_CH=472.885
.param wn2_CH = 2*pi*fn2_CH
.param Q2_CH = 2.5355
.param zeta2_CH=1/(2*Q2_CH)
* Natural frequency (Hz)
* Natural frequency (Radians)
* Damping Coefficient
* Quality Factor
* Quality Factor
* Chebyshev 0.25dB 4th order coefficients
* Biquad 2
* Fc = 500Hz
* .tran 20m
* BIQUAD MULTIPLE FEEDBACK nominal
* BIQUAD TOW-THOMAS (T-T) nominal
* BIQUAD MULTIPLE FEEDBACK
* BIQUAD TOW-THOMAS (T-T)
* FILTRU COMPLET nominal
.lib UniversalOpAmp2.lib
.backanno
.end